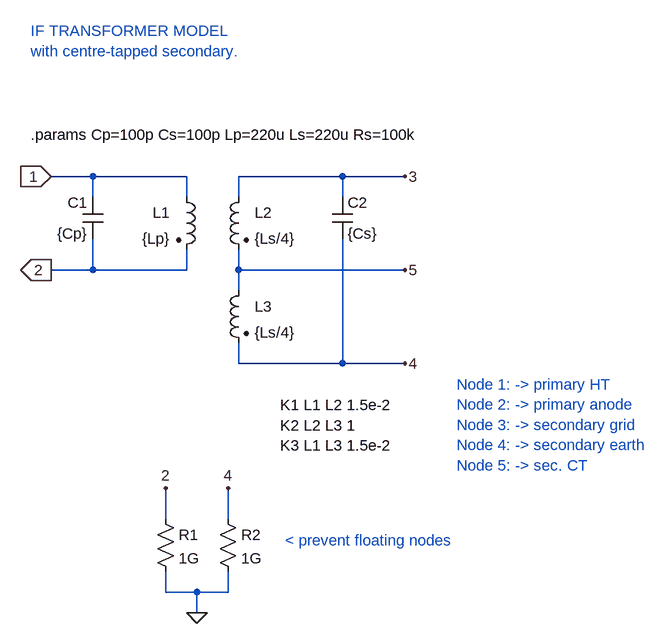
[diagram p0: schematic FM IF detector TX master.asc]
FM IF detector TX master.asc, the LTspice schematic file:
Version 4
SHEET 1 1192 868
WIRE -112 -48 -176 -48
WIRE 32 -48 -112 -48
WIRE 272 -48 112 -48
WIRE 368 -48 272 -48
WIRE -112 -16 -112 -48
WIRE 32 -16 32 -48
WIRE 112 -16 112 -48
WIRE 272 -16 272 -48
WIRE -112 96 -112 48
WIRE -112 96 -176 96
WIRE 32 96 32 64
WIRE 32 96 -112 96
WIRE 112 96 112 64
WIRE 368 96 112 96
WIRE 112 128 112 96
WIRE 112 240 112 208
WIRE 272 240 272 48
WIRE 272 240 112 240
WIRE 368 240 272 240
WIRE 0 480 0 432
WIRE 96 480 96 432
WIRE 0 592 0 560
WIRE 48 592 0 592
WIRE 96 592 96 560
WIRE 96 592 48 592
WIRE 48 624 48 592
FLAG 48 624 0
FLAG 0 432 2
FLAG 96 432 4
FLAG -176 -48 1
IOPIN -176 -48 In
FLAG -176 96 2
IOPIN -176 96 Out
FLAG 368 -48 3
FLAG 368 240 4
FLAG 368 96 5
SYMBOL res -16 464 R0
SYMATTR InstName R1
SYMATTR Value 1G
SYMBOL res 80 464 R0
SYMATTR InstName R2
SYMATTR Value 1G
SYMBOL ind2 16 -32 R0
WINDOW 0 -9 40 Right 0
WINDOW 3 -9 80 Right 0
SYMATTR InstName L1
SYMATTR Value {Lp}
SYMATTR Type ind
SYMATTR SpiceLine Rser=1 Rpar=100k
SYMBOL ind2 128 -32 M0
WINDOW 0 -9 40 Right 0
WINDOW 3 -9 80 Right 0
SYMATTR InstName L2
SYMATTR Value {Ls/4}
SYMATTR Type ind
SYMATTR SpiceLine Rser=1 Rpar={Rs/2}
SYMBOL ind2 128 112 M0
WINDOW 0 -9 40 Right 0
WINDOW 3 -9 80 Right 0
SYMATTR InstName L3
SYMATTR Value {Ls/4}
SYMATTR Type ind
SYMATTR SpiceLine Rser=1 Rpar={Rs/2}
SYMBOL cap -96 -16 M0
SYMATTR InstName C1
SYMATTR Value {Cp}
SYMBOL cap 256 -16 R0
SYMATTR InstName C2
SYMATTR Value {Cs}
TEXT -208 -272 Left 0 ;IF TRANSFORMER MODEL\nwith centre-tapped secondary.
TEXT 448 272 Left 0 ;Node 1: -> primary HT\nNode 2: -> primary anode\nNode 3: -> secondary grid\nNode 4: -> secondary earth\nNode 5: -> sec. CT
TEXT 184 512 Left 0 ;< prevent floating nodes
TEXT -208 -112 Left 0 !.params Cp=100p Cs=100p Lp=220u Ls=220u Rs=100k
TEXT 176 304 Left 0 !K1 L1 L2 1.5e-2\nK2 L2 L3 1\nK3 L1 L3 1.5e-2

The netlist it stands for:
* FM IF detector TX master.asc
R1 2 0 1G
R2 4 0 1G
L1 1 2 {Lp} Rser=1 Rpar=100k
L2 3 5 {Ls/4} Rser=1 Rpar={Rs/2}
L3 5 4 {Ls/4} Rser=1 Rpar={Rs/2}
C1 1 2 {Cp}
C2 3 4 {Cs}
* IF TRANSFORMER MODEL
* with centre-tapped secondary.
* Node 1: -> primary HT
* Node 2: -> primary anode
* Node 3: -> secondary grid
* Node 4: -> secondary earth
* Node 5: -> sec. CT
* < prevent floating nodes
.params Cp=100p Cs=100p Lp=220u Ls=220u Rs=100k
K1 L1 L2 1.5e-2
K2 L2 L3 1
K3 L1 L3 1.5e-2
.backanno
.end